# Altium schematic sheet Trepanat_Pressure.SchDoc
size 594 x 420 mm; DocumentNumber: ПРО 2018.001 Э3; SheetNumber: 4; Format: A2
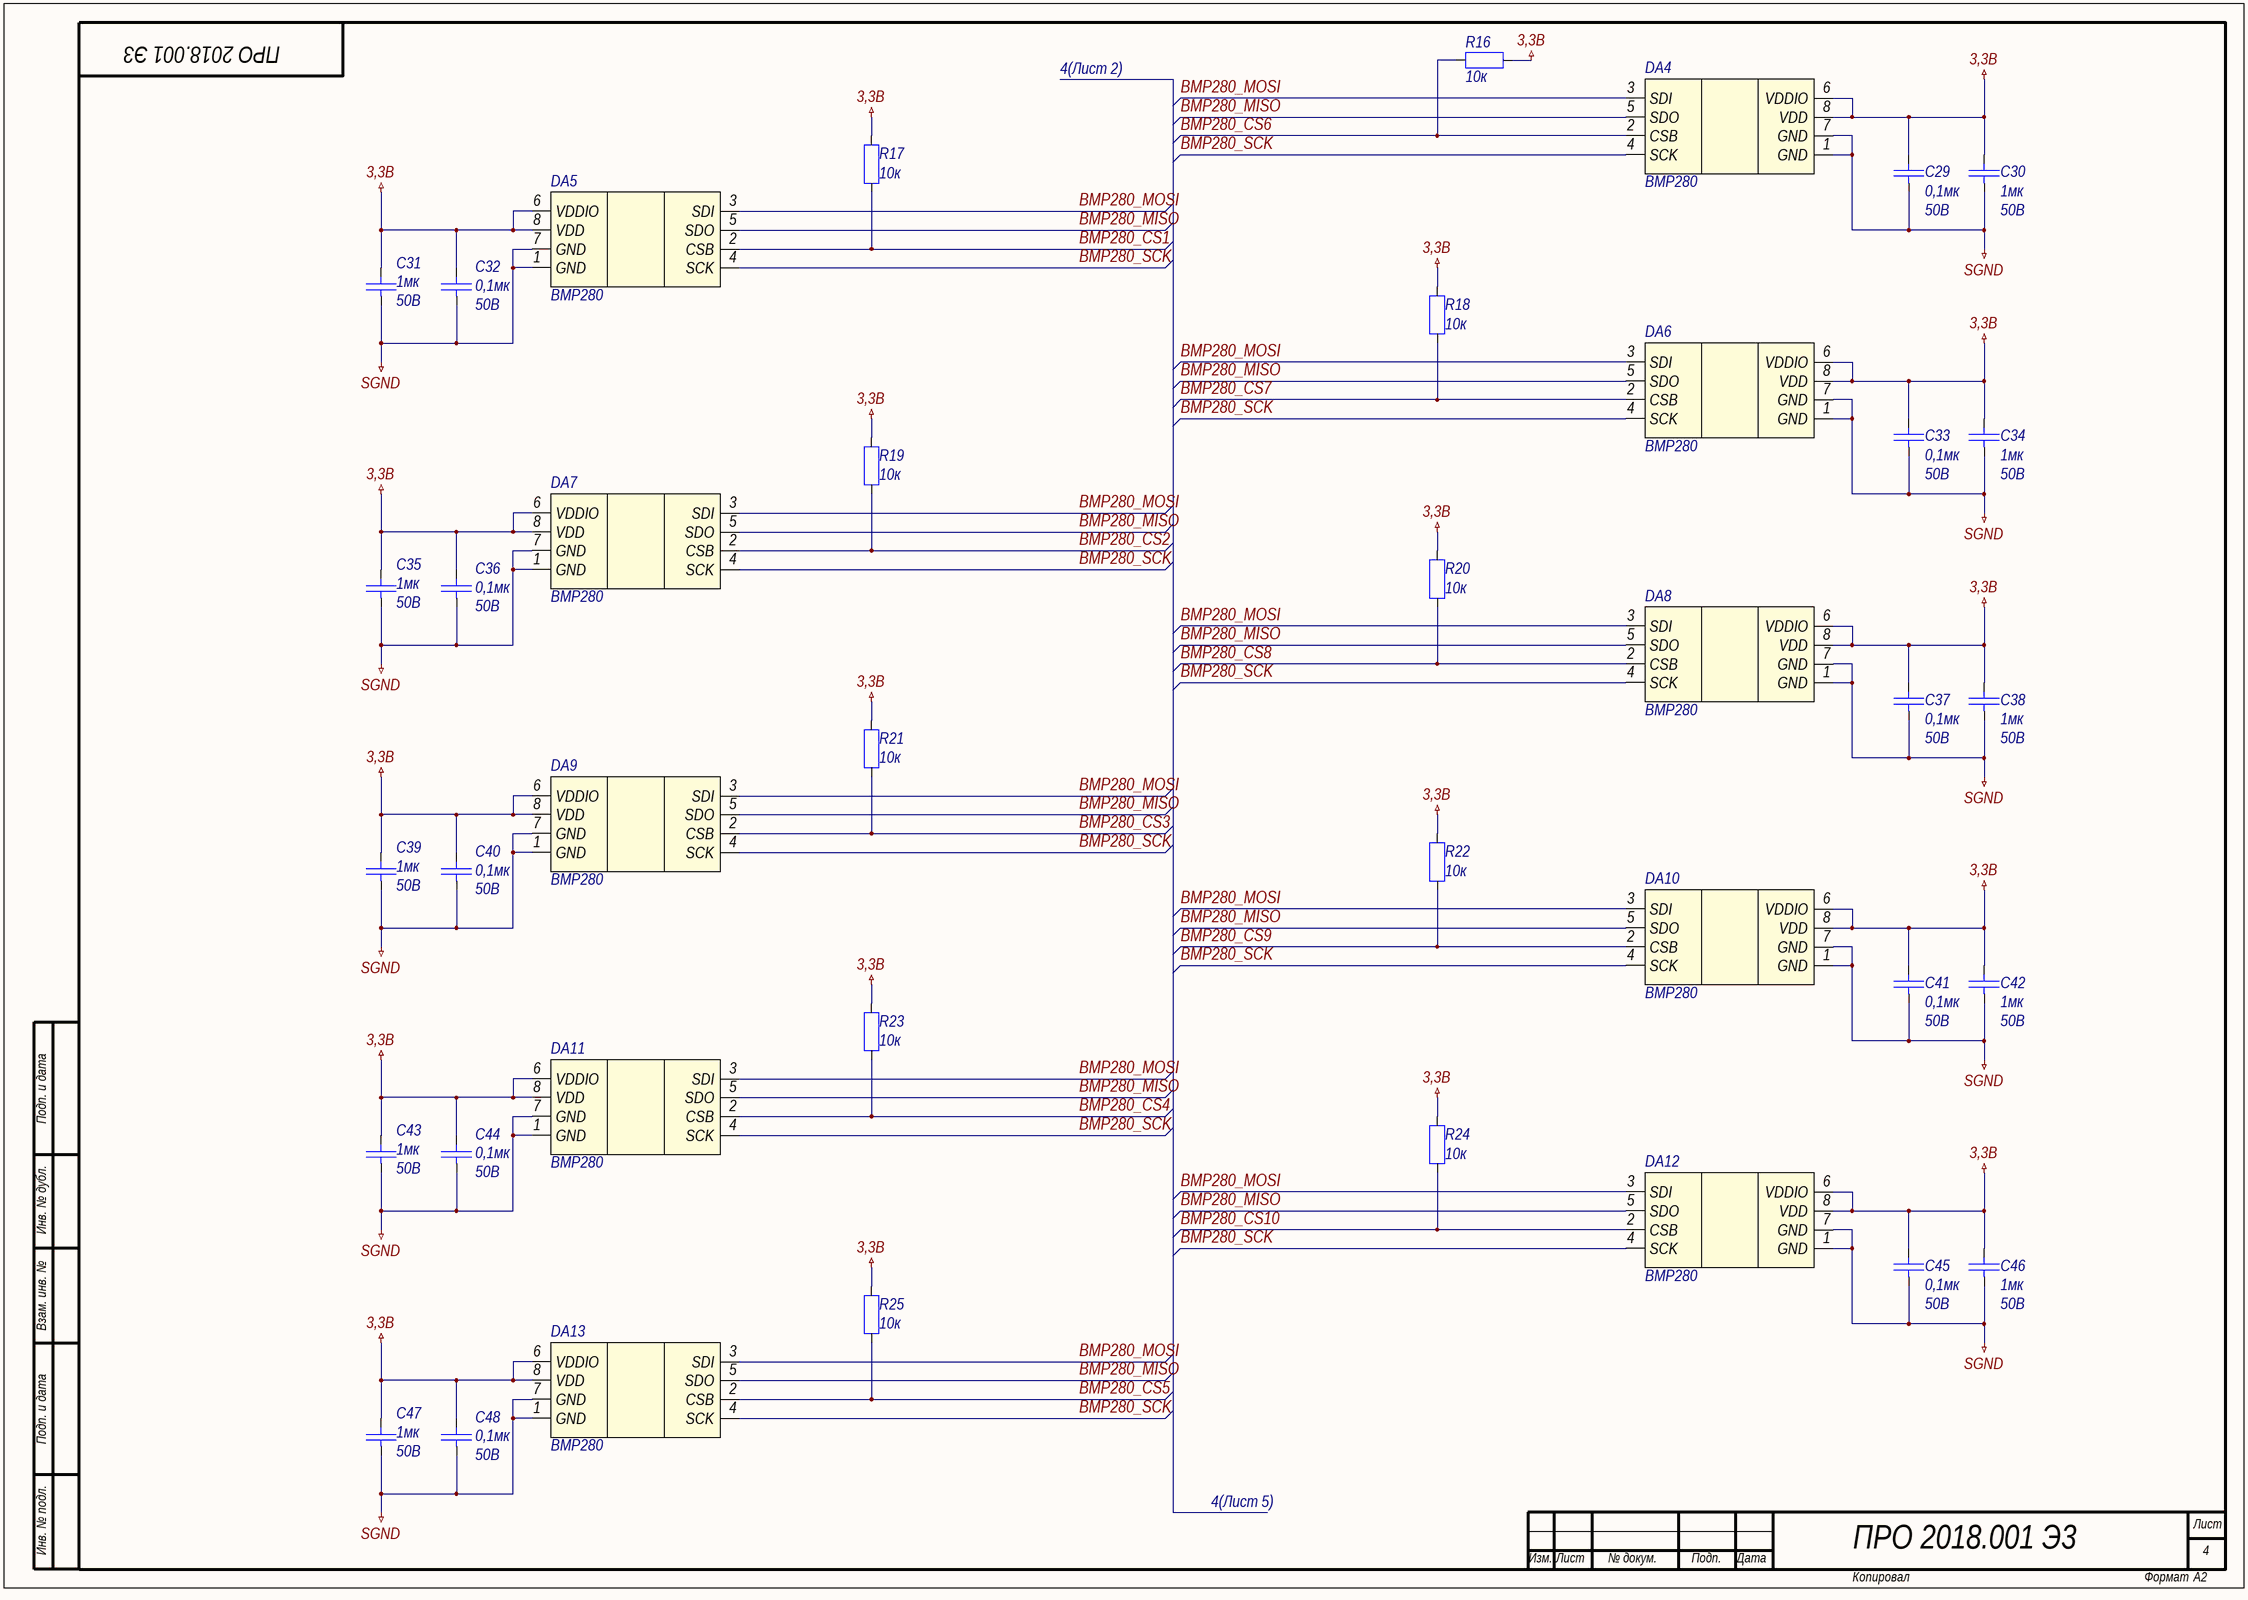
[diagram p0: Trepanat_Pressure.SchDoc]

## Parts
C29  0,1мк  Voltage: 50В  [C0805]
C30  1мк  Voltage: 50В  [C0805]
C31  1мк  Voltage: 50В  [C0805]
C32  0,1мк  Voltage: 50В  [C0805]
C33  0,1мк  Voltage: 50В  [C0805]
C34  1мк  Voltage: 50В  [C0805]
C35  1мк  Voltage: 50В  [C0805]
C36  0,1мк  Voltage: 50В  [C0805]
C37  0,1мк  Voltage: 50В  [C0805]
C38  1мк  Voltage: 50В  [C0805]
C39  1мк  Voltage: 50В  [C0805]
C40  0,1мк  Voltage: 50В  [C0805]
C41  0,1мк  Voltage: 50В  [C0805]
C42  1мк  Voltage: 50В  [C0805]
C43  1мк  Voltage: 50В  [C0805]
C44  0,1мк  Voltage: 50В  [C0805]
C45  0,1мк  Voltage: 50В  [C0805]
C46  1мк  Voltage: 50В  [C0805]
C47  1мк  Voltage: 50В  [C0805]
C48  0,1мк  Voltage: 50В  [C0805]
DA4  BMP280  [BMP280]
DA5  BMP280  [BMP280]
DA6  BMP280  [BMP280]
DA7  BMP280  [BMP280]
DA8  BMP280  [BMP280]
DA9  BMP280  [BMP280]
DA10  BMP280  [BMP280]
DA11  BMP280  [BMP280]
DA12  BMP280  [BMP280]
DA13  BMP280  [BMP280]
R16  10к  [R0805]
R17  10к  [R0805]
R18  10к  [R0805]
R19  10к  [R0805]
R20  10к  [R0805]
R21  10к  [R0805]
R22  10к  [R0805]
R23  10к  [R0805]
R24  10к  [R0805]
R25  10к  [R0805]

## Nets
3,3B: C29.2 C30.2 C31.2 C32.2 C33.2 C34.2 C35.2 C36.2 C37.2 C38.2 C39.2 C40.2 C41.2 C42.2 C43.2 C44.2 C45.2 C46.2 C47.2 C48.2 DA4.6(VDDIO) DA4.8(VDD) DA5.6(VDDIO) DA5.8(VDD) DA6.6(VDDIO) DA6.8(VDD) DA7.6(VDDIO) DA7.8(VDD) DA8.6(VDDIO) DA8.8(VDD) DA9.6(VDDIO) DA9.8(VDD) DA10.6(VDDIO) DA10.8(VDD) DA11.6(VDDIO) DA11.8(VDD) DA12.6(VDDIO) DA12.8(VDD) DA13.6(VDDIO) DA13.8(VDD) R16.1 R17.1 R18.1 R19.1 R20.1 R21.1 R22.1 R23.1 R24.1 R25.1
SGND: C29.1 C30.1 C31.1 C32.1 C33.1 C34.1 C35.1 C36.1 C37.1 C38.1 C39.1 C40.1 C41.1 C42.1 C43.1 C44.1 C45.1 C46.1 C47.1 C48.1 DA4.1(GND) DA4.7(GND) DA5.1(GND) DA5.7(GND) DA6.1(GND) DA6.7(GND) DA7.1(GND) DA7.7(GND) DA8.1(GND) DA8.7(GND) DA9.1(GND) DA9.7(GND) DA10.1(GND) DA10.7(GND) DA11.1(GND) DA11.7(GND) DA12.1(GND) DA12.7(GND) DA13.1(GND) DA13.7(GND)
BMP280_CS1: DA5.2(CSB) R17.2
BMP280_CS2: DA7.2(CSB) R19.2
BMP280_CS3: DA9.2(CSB) R21.2
BMP280_CS4: DA11.2(CSB) R23.2
BMP280_CS5: DA13.2(CSB) R25.2
BMP280_CS6: DA4.2(CSB) R16.2
BMP280_CS7: DA6.2(CSB) R18.2
BMP280_CS8: DA8.2(CSB) R20.2
BMP280_CS9: DA10.2(CSB) R22.2
BMP280_CS10: DA12.2(CSB) R24.2
BMP280_MISO: DA4.5(SDO) DA5.5(SDO) DA6.5(SDO) DA7.5(SDO) DA8.5(SDO) DA9.5(SDO) DA10.5(SDO) DA11.5(SDO) DA12.5(SDO) DA13.5(SDO)
BMP280_MOSI: DA4.3(SDI) DA5.3(SDI) DA6.3(SDI) DA7.3(SDI) DA8.3(SDI) DA9.3(SDI) DA10.3(SDI) DA11.3(SDI) DA12.3(SDI) DA13.3(SDI)
BMP280_SCK: DA4.4(SCK) DA5.4(SCK) DA6.4(SCK) DA7.4(SCK) DA8.4(SCK) DA9.4(SCK) DA10.4(SCK) DA11.4(SCK) DA12.4(SCK) DA13.4(SCK)

## Notes on the sheet
- 4(Лист 2)
- Подп. и дата
- Инв. № дубл.
- Взам. инв. №
- 4(Лист 5)
- Инв. № подл.
- Лист
- Изм.
- № докум.
- Подп.
- Дата
- Копировал
- Формат

## Library data of the parts
C29-C48 = Capacitor: Конденсатор
  C29 C32 C33 C36 C37 C40 C41 C44 C45 C48: Value: 0,1мк
  C30 C31 C34 C35 C38 C39 C42 C43 C46 C47: Value: 1мк
DA4-DA13 = BMP280: BMP280 Barometric Sensor; Name: BMP280
R16-R25 = Resistor: Резистор; Value: 10к